# EAGLE design 220VAC-28VDC_Converter (EAGLE 9.0.1)
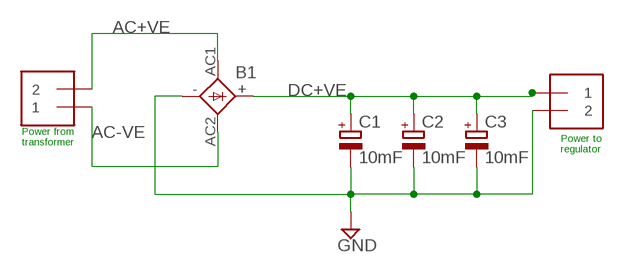
[diagram p0: schematic, sheet 1]

## Parts
B1  KBU  [KBU]
C1  10mF  CPOL-EUE10-35  [EB35D]
C2  10mF  CPOL-EUE10-35  [EB35D]
C3  10mF  CPOL-EUE10-35  [EB35D]
J1  1X2-3.5MM  [1X2-3.5MM]
J2  1X2-3.5MM  [1X2-3.5MM]

## Nets
AC+VE: B1.AC1 J1.2
AC-VE: B1.AC2 J1.1
DC+VE: B1.+ C1.+ C2.+ C3.+ J2.1
GND: B1.- C1.- C2.- C3.- J2.2

## Notes on the sheet
- Power from 
  transformer
- Power to 
  regulator

## Library data of the parts
B1 = rectifier:KBU: DIOTEC RECTIFIER
C1-C3 = rcl:CPOL-EU: POLARIZED CAPACITOR, European symbol; SPICEPREFIX: C
J1 J2 = adafruit:1X2: 3.5mm Terminal block http://www.ladyada.net/library/pcb/eaglelibrary.html

## Board
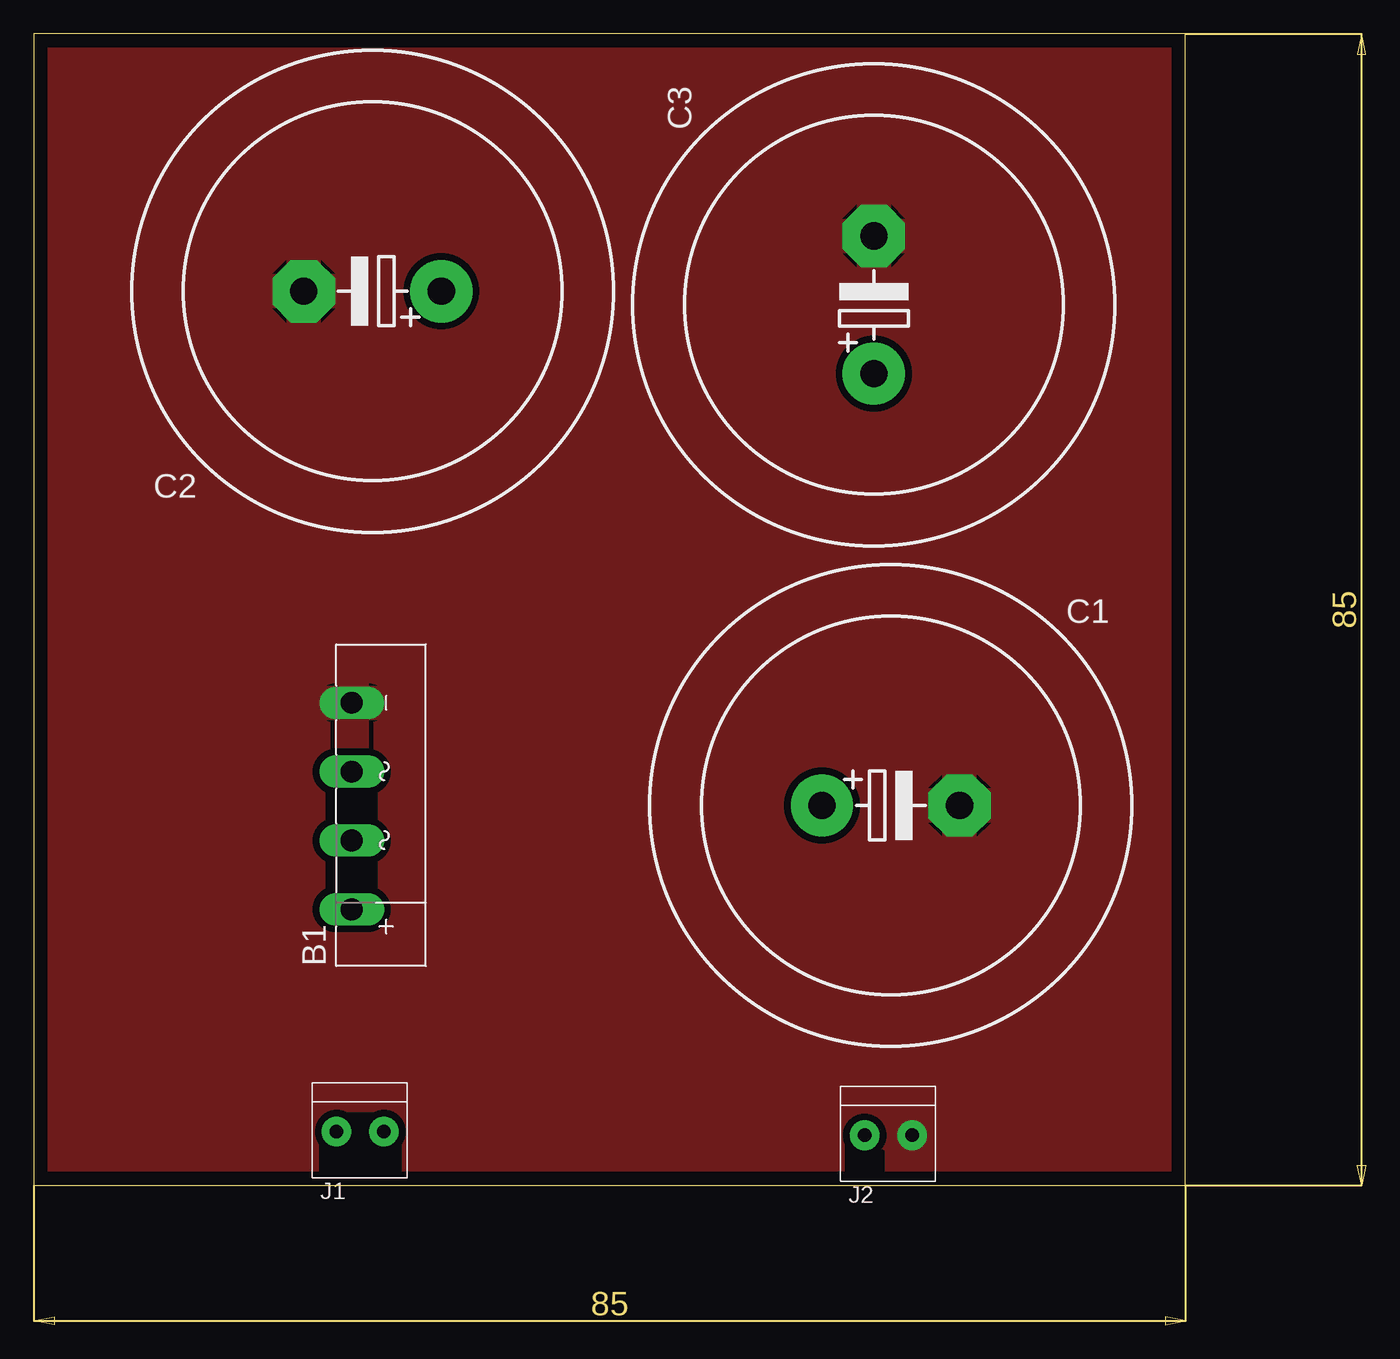
[diagram p1: board, top side]
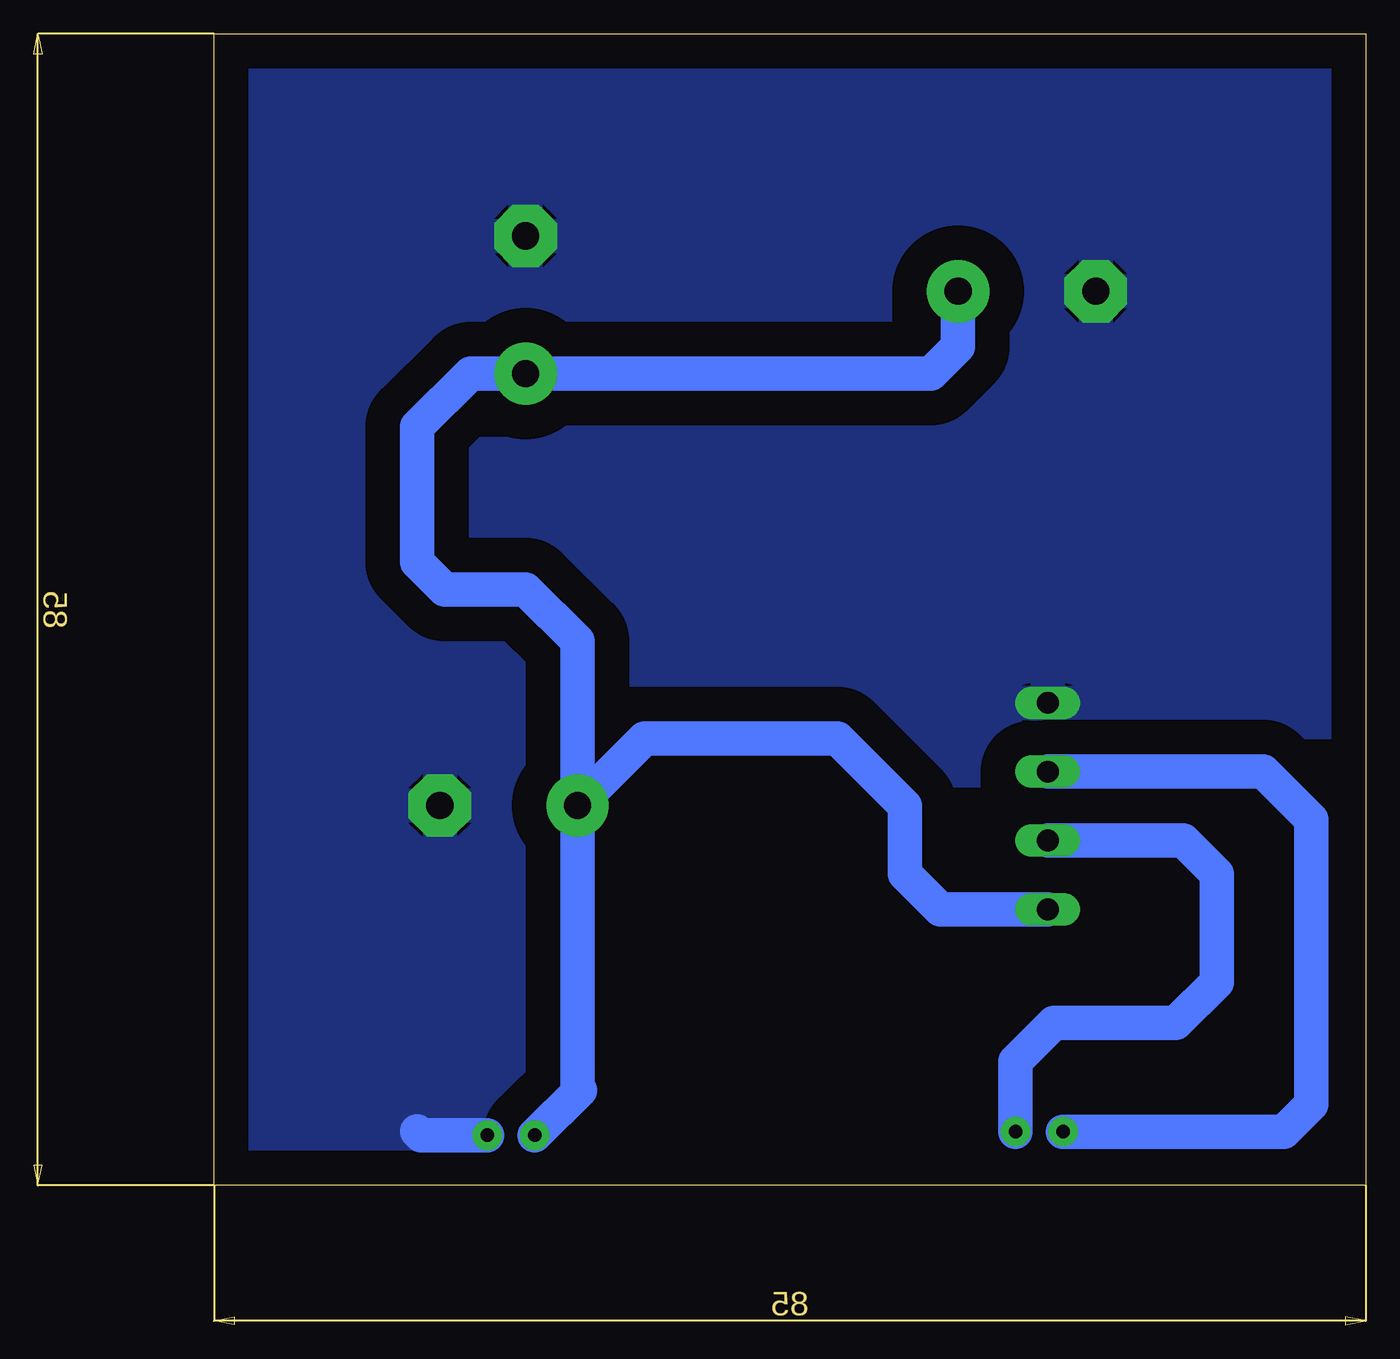
[diagram p2: board, bottom side, seen from below]

Size 85 x 85 mm. Coordinates in mm from the lower left corner, seen from the top.
Outline: 0,0 85,0 85,85 0,85 0,0
Copper layers (1*16): Top 0.035mm / dielectric 1.5mm / Bottom 0.035mm
Design rules "default *": minimum track width 6mil, minimum drill 0.35mm, track to track 0.5mm, track to pad 1mm, pad to pad 6mil, via to via 2.5mm, smd to smd 6mil, copper to edge 40mil, drill to drill 6mil, minimum pad ring 10mil, minimum via ring 8mil, stop-mask expansion 4mil, vias tented up to drill 0mil, thermal gap 10mil

### Footprints (pad centres in the part's own frame; a part is rotated, then mirrored left to right if it is on the bottom)
KBU = drill 1.6 long: + -7.62,2.54; - 7.62,2.54; AC1 -2.54,2.54; AC2 2.54,2.54
EB35D = drill 2.007 pad 4.597: + -5.08,0 | drill 2.007 pad 4.597 octagon: - 5.08,0
1X2-3.5MM = drill 1 pad 2.184: 1 1.8,0; 2 -1.7,0

### Placement (x,y rotation side)
B1  26,28 90 top
C1  63.25,28.05 0 top
C2  25,66 180 top
C3  62,65 90 top
J1  24.14,3.97 180 top
J2  63.13,3.7 180 top

### Tracks (layer width: path | path; a pad name or v marks a point on that pad's centre or on a via)
AC+VE
  Bottom 2.54: B1.AC1 13.46,25.46 11,23 11,15 14,12 23,12 25.84,9.16 J1.2
AC-VE
  Bottom 2.54: J1.1 6.03,3.97 4,6 4,27 7.54,30.54 B1.AC2
DC+VE
  Bottom 2.54: B1.+ 31.38,20.38 34,23 34,28 39,33 53.22,33 C1.+ | J2.1 58,7.03 58.17,7.2 C1.+ | C1.+ 58.17,40.17 62,44 68,44 70,46 70,56 66.08,59.92 C3.+ 32.08,59.92 30.08,61.92 C2.+
GND
  Bottom 2.54: J2.2 69.7,3.7 70,4
  pour Bottom (isolate 2.54): 0,0 85,0 85,85 0,85
  pour Top: 0,0 85,0 85,85 0,85